# Altium project MKXdbV2.PrjPCB (part 2 of 2)

## Sheet MKXdbV2_PWR.SchDoc
size A
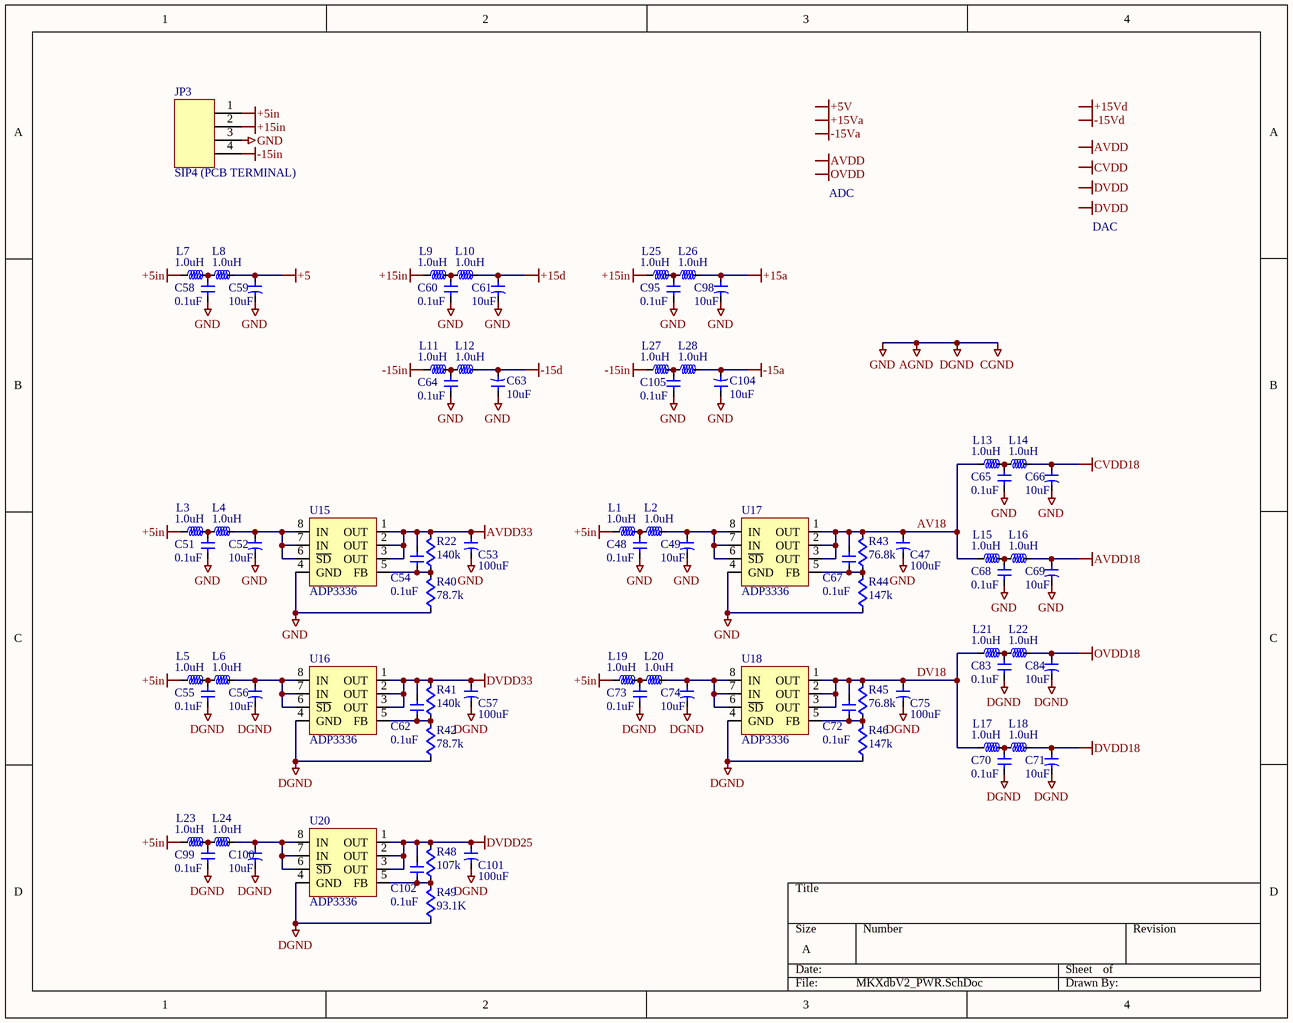
[diagram p3: MKXdbV2_PWR.SchDoc]

### Parts
(Parts that share a designator on the sheet are numbered #1, #2 ... from top to bottom, then left to right.)
C47  100uF  [1206]
C48  0.1uF  [0603w]
C49  10uF  [1206]
C51  0.1uF  [0603w]
C52  10uF  [1206]
C53  100uF  [1206]
C54  0.1uF  [0603w]
C55  0.1uF  [0603w]
C56  10uF  [1206]
C57  100uF  [1206]
C58  0.1uF  [0603w]
C59  10uF  [1206]
C60  0.1uF  [0603w]
C61  10uF  [1206]
C62  0.1uF  [0603w]
C63  10uF  [1206]
C64  0.1uF  [0603w]
C65  0.1uF  [0603w]
C66  10uF  [1206]
C67  0.1uF  [0603w]
C68  0.1uF  [0603w]
C69  10uF  [1206]
C70  0.1uF  [0603w]
C71  10uF  [1206]
C72  0.1uF  [0603w]
C73  0.1uF  [0603w]
C74  10uF  [1206]
C75  100uF  [1206]
C83  0.1uF  [0603w]
C84  10uF  [1206]
C95  0.1uF  [0603w]
C98  10uF  [1206]
C99  0.1uF  [0603w]
C100  10uF  [1206]
C101#1  100uF  [1206]
C102#1  0.1uF  [0603w]
C104#1  10uF  [1206]
C105#1  0.1uF  [0603w]
JP3  SIP4 (PCB TERMINAL)  [SIP4MOLEX]
L1  1.0uH  [1210]
L2  1.0uH  [1210]
L3  1.0uH  [0805]
L4  1.0uH  [0805]
L5  1.0uH  [0805]
L6  1.0uH  [0805]
L7  1.0uH  [1210]
L8  1.0uH  [1210]
L9  1.0uH  [1210]
L10  1.0uH  [1210]
L11  1.0uH  [1210]
L12  1.0uH  [1210]
L13  1.0uH  [0805]
L14  1.0uH  [0805]
L15  1.0uH  [1210]
L16  1.0uH  [1210]
L17  1.0uH  [0805]
L18  1.0uH  [0805]
L19  1.0uH  [0805]
L20  1.0uH  [0805]
L21  1.0uH  [0805]
L22  1.0uH  [0805]
L23  1.0uH  [0805]
L24  1.0uH  [0805]
L25  1.0uH  [1210]
L26  1.0uH  [1210]
L27  1.0uH  [1210]
L28  1.0uH  [1210]
R22  140k  [0603w]
R40  78.7k  [0603w]
R41  140k  [0603w]
R42  78.7k  [0603w]
R43  76.8k  [0603w]
R44  147k  [0603w]
R45  76.8k  [0603w]
R46  147k  [0603w]
R48  107k  [0603w]
R49  93.1K  [0603w]
U15  ADP3336  [MSOP08]
U16  ADP3336  [MSOP08]
U17  ADP3336  [MSOP08]
U18  ADP3336  [MSOP08]
U20  ADP3336  [MSOP08]

### Nets
+5: C59.1 L8.2
+5in: JP3.1 L1.1 L3.1 L5.1 L7.1 L19.1 L23.1
+15a: C98.1 L26.2
+15d: C61.1 L10.2
+15in: JP3.2 L9.1 L25.1
-15a: C104#1.2 L28.2
-15d: C63.2 L12.2
-15in: JP3.4 L11.1 L27.1
AGND: C47.2 C48.2 C49.2 C51.2 C52.2 C53.2 C55.2 C56.2 C57.2 C58.2 C59.2 C60.2 C61.2 C63.1 C64.2 C65.2 C66.2 C68.2 C69.2 C70.2 C71.2 C73.2 C74.2 C75.2 C83.2 C84.2 C95.2 C98.2 C99.2 C100.2 C101#1.2 C104#1.1 C105#1.2 JP3.3 R40.1 R42.1 R44.1 R46.1 R49.1 U15.4(GND) U16.4(GND) U17.4(GND) U18.4(GND) U20.4(GND)  [also labelled CGND, DGND, GND]
AVDD18: C69.1 L16.2
AVDD33: C53.1 C54.1 R22.2 U15.1(OUT) U15.2(OUT) U15.3(OUT)
CVDD18: C66.1 L14.2
DVDD18: C71.1 L18.2
DVDD25: C101#1.1 C102#1.1 R48.2 U20.1(OUT) U20.2(OUT) U20.3(OUT)
DVDD33: C57.1 C62.1 R41.2 U16.1(OUT) U16.2(OUT) U16.3(OUT)
OVDD18: C84.1 L22.2
AV18: C47.1 C67.1 L13.1 L15.1 R43.2 U17.1(OUT) U17.2(OUT) U17.3(OUT)
DV18: C72.1 C75.1 L17.1 L21.1 R45.2 U18.1(OUT) U18.2(OUT) U18.3(OUT)
NetC48_1: C48.1 L1.2 L2.1
NetC49_1: C49.1 L2.2 U17.6(~{SD}) U17.7(IN) U17.8(IN)
NetC51_1: C51.1 L3.2 L4.1
NetC52_1: C52.1 L4.2 U15.6(~{SD}) U15.7(IN) U15.8(IN)
NetC54_2: C54.2 R22.1 R40.2 U15.5(FB)
NetC55_1: C55.1 L5.2 L6.1
NetC56_1: C56.1 L6.2 U16.6(~{SD}) U16.7(IN) U16.8(IN)
NetC58_1: C58.1 L7.2 L8.1
NetC60_1: C60.1 L9.2 L10.1
NetC62_2: C62.2 R41.1 R42.2 U16.5(FB)
NetC64_1: C64.1 L11.2 L12.1
NetC65_1: C65.1 L13.2 L14.1
NetC67_2: C67.2 R43.1 R44.2 U17.5(FB)
NetC68_1: C68.1 L15.2 L16.1
NetC70_1: C70.1 L17.2 L18.1
NetC72_2: C72.2 R45.1 R46.2 U18.5(FB)
NetC73_1: C73.1 L19.2 L20.1
NetC74_1: C74.1 L20.2 U18.6(~{SD}) U18.7(IN) U18.8(IN)
NetC83_1: C83.1 L21.2 L22.1
NetC95_1: C95.1 L25.2 L26.1
NetC99_1: C99.1 L23.2 L24.1
NetC100_1: C100.1 L24.2 U20.6(~{SD}) U20.7(IN) U20.8(IN)
NetC102#1_2: C102#1.2 R48.1 R49.2 U20.5(FB)
NetC105#1_1: C105#1.1 L27.2 L28.1

### Notes on the sheet
- ADC
- DAC
- Labels drawn without touching a wire or pin: +5V, +15Va, +15Vd, -15Va, -15Vd, AVDD, CVDD, DVDD, OVDD

### Library data of the parts
C47 C53 C57 C75 C101#1 = CAPACITOR_SM: capacitor; Manufacturer: TDK Corporation; Manufacturer Part Number: C3216X5R0J107M; Capacitance: 100µF; Voltage - Rated: 6.3V; Tolerance: ±20%; Temperature Coefficient: X5R; Supplier 1: Digi-Key; Supplier Part Number 1: 445-6008-1-ND; RoHS: RoHS Compliant; Category: Capacitors; Stock 1: 10697; Pricing 1: 1=1.24, 10=1.034, 100=0.759, 250=0.66, 500=0.616, 1000=0.484 (USD); Mounting Type: Surface Mount, MLCC; Operating Temperature: -55°C ~ 85°C; Applications: General Purpose; Ratings: -; Package / Case: 1206 (3216 Metric); Size / Dimension: 0.126" L x 0.063" W (3.20mm x 1.60mm); Height: -; Thickness: 0.071" (1.80mm); Lead Spacing: -; Features: Low ESR; Packaging: Cut Tape (CT); Lead Style: -; ComponentLink1URL: http://www.tdk.com/pdf/general_A11.pdf; ComponentLink1Description: http://www.tdk.com/pdf/general_A11.pdf
C48 C51 C54 C55 C58 C60 C62 C64 C65 C67 C68 C70 C72 C73 C83 C95 C99 C102#1 C105#1 = CAP_SM: capacitor; Manufacturer: Kemet; Manufacturer Part Number: C0603C104K3RACTU; Capacitance: 0.1µF; Temperature Coefficient: X7R; Tolerance: ±10%; Voltage - Rated: 25V; Applications: General Purpose; Category: Capacitors; ComponentLink1Description: http://www.kemet.com/datasheets&C0603C104K3RACTU; ComponentLink1URL: http://www.kemet.com/datasheets&C0603C104K3RACTU; Features: -; Lead Spacing: -; Lead Style: -; Mounting Type: Surface Mount, MLCC; Operating Temperature: -55°C ~ 125°C; Package / Case: 0603 (1608 Metric); Packaging: Cut Tape (CT); Pricing 1: 10=0.075, 100=0.027, 250=0.01952, 500=0.0144, 1000=0.00975 (USD); Ratings: -; RoHS: RoHS Compliant; Size / Dimension: 0.063" L x 0.032" W (1.60mm x 0.80mm); Stock 1: 2338960; Supplier 1: Digi-Key; Supplier Part Number 1: 399-1281-1-ND; Thickness: 0.80mm
C49 C52 C56 C59 C61 C63 C66 C69 C71 C74 C84 C100 C104#1 = CAPACITOR_SM: ELECTROLYTIC capacitor; Manufacturer: Nichicon; Manufacturer Part Number: F971C106MAA; Manufacturer Size Code: A; Capacitance: 10µF; Temperature Coefficient: X5R; Tolerance: ±20%; Voltage - Rated: 16V; ESR (Equivalent Series Resistance): 3.500 Ohm; Type: Molded; Applications: General Purpose; Category: Capacitors; ComponentLink1Description: http://nichicon-us.com/english/products/pdf/e-f97.pdf; ComponentLink1URL: http://nichicon-us.com/english/products/pdf/e-f97.pdf; Features: High Reliability; Height: 0.071" (1.80mm); Lead Spacing: -; Lead Style: -; Mounting Type: Surface Mount; Operating Temperature: -55°C ~ 125°C; Package / Case: 1206 (3216 Metric); Packaging: Cut Tape (CT); Pricing 1: 1=0.5, 10=0.398, 100=0.24, 250=0.18, 500=0.1536, 1000=0.12 (USD); Ratings: -; RoHS: RoHS Compliant; Size / Dimension: 0.126" L x 0.063" W (3.20mm x 1.60mm); Stock 1: 885; Supplier 1: Digi-Key; Supplier Part Number 1: 493-4304-1-ND; Thickness: 0.071" (1.80mm); Lifetime @ Temp.: -
C98 = CAPACITOR_SM: ELECTROLYTIC capacitor; Manufacturer: Nichicon; Manufacturer Part Number: F971C106MAA; Manufacturer Size Code: A; Capacitance: 10µF; Voltage - Rated: 16V; Tolerance: ±20%; Temperature Coefficient: X5R; ESR (Equivalent Series Resistance): 3.500 Ohm; Type: Molded; Supplier 1: Digi-Key; Supplier Part Number 1: 493-4304-1-ND; RoHS: RoHS Compliant; Category: Capacitors; Stock 1: 885; Pricing 1: 1=0.5, 10=0.398, 100=0.24, 250=0.18, 500=0.1536, 1000=0.12 (USD); Mounting Type: Surface Mount; Operating Temperature: -55°C ~ 125°C; Applications: General Purpose; Ratings: -; Package / Case: 1206 (3216 Metric); Size / Dimension: 0.126" L x 0.063" W (3.20mm x 1.60mm); Height: 0.071" (1.80mm); Thickness: 0.071" (1.80mm); Lead Spacing: -; Features: High Reliability; Packaging: Cut Tape (CT); Lead Style: -; ComponentLink1URL: http://nichicon-us.com/english/products/pdf/e-f97.pdf; ComponentLink1Description: http://nichicon-us.com/english/products/pdf/e-f97.pdf; Lifetime @ Temp.: -
JP3 = SIP4 (PCB TERMINAL): 4 pin molex connector; Manufacturer: Molex Inc; Connector Type: Header, Unshrouded; Number of Positions: 4; Number of Positions Loaded: All; Pitch: 0.100" (2.54mm); Supplier 1: Digi-Key; Supplier Part Number 1: WM2746-ND; Manufacturer Part Number: 22-29-2041; RoHS: RoHS Compliant; Category: Connectors, Interconnects; Stock 1: 6126; Pricing 1: 1=0.95, 10=0.664, 50=0.5124, 100=0.446, 250=0.3796, 500=0.36062, 1000=0.32266, 2500=0.25623, 5000=0.25243 (USD); Contact Type: Male Pin; Number of Rows: 1; Row Spacing: -; Contact Mating Length: 0.295" (7.49mm); Mounting Type: Through Hole; Termination: Solder; Fastening Type: Friction Lock; Features: -; Contact Finish: Gold; Contact Finish Thickness: 20µin (0.51µm); Color: White; Packaging: Bulk; ComponentLink1URL: http://www.molex.com/pdm_docs/sd/022292041_sd.pdf; ComponentLink1Description: http://www.molex.com/pdm_docs/sd/022292041_sd.pdf
L1 L7 L9 L11 L15 L25 L27 = INDUCTOR_SM: inductor; Manufacturer: Murata Electronics North America; Manufacturer Part Number: LQH32CN1R0M23L; Current: 800mA; DC Resistance (DCR): 117 mOhm Max; Frequency - Test: 1MHz; Inductance: 1µH; Self Resonant Freq: 96MHz; Shielding: Unshielded; Tolerance: ±20%; Type: Ferrite Core; Material - Core: Ferrite; Applications: Power Supplies; Category: Inductors, Coils, Chokes; ComponentLink1Description: http://search.murata.co.jp/Ceramy/image/img/PDF/ENG/L0075S0093LQH32C_23~33.pdf; ComponentLink1URL: http://search.murata.co.jp/Ceramy/image/img/PDF/ENG/L0075S0093LQH32C_23~33.pdf; Current - Saturation: -; Current - Temperature Rise: -; Mounting Type: Surface Mount; Operating Temperature: -40°C ~ 85°C; Package / Case: 1210 (3225 Metric); Packaging: Cut Tape (CT); Q @ Freq: -; RoHS: RoHS Compliant; Supplier 1: Digi-Key; Supplier Part Number 1: 490-2493-1-ND; Stock 1: 5265; Pricing 1: 1=0.27, 10=0.258, 50=0.2422, 100=0.2261, 500=0.17766, 1000=0.14535 (USD)
L2 L8 L10 L12 L16 L26 L28 = INDUCTOR_SM: inductor; Manufacturer: Murata Electronics North America; Manufacturer Part Number: LQH32CN1R0M23L; Inductance: 1µH; Current: 800mA; Type: Ferrite Core; Tolerance: ±20%; Shielding: Unshielded; DC Resistance (DCR): 117 mOhm Max; Self Resonant Freq: 96MHz; Frequency - Test: 1MHz; Material - Core: Ferrite; RoHS: RoHS Compliant; Category: Inductors, Coils, Chokes; Current - Saturation: -; Current - Temperature Rise: -; Q @ Freq: -; Package / Case: 1210 (3225 Metric); Mounting Type: Surface Mount; Packaging: Cut Tape (CT); Operating Temperature: -40°C ~ 85°C; Applications: Power Supplies; ComponentLink1URL: http://search.murata.co.jp/Ceramy/image/img/PDF/ENG/L0075S0093LQH32C_23~33.pdf; ComponentLink1Description: http://search.murata.co.jp/Ceramy/image/img/PDF/ENG/L0075S0093LQH32C_23~33.pdf; Supplier 1: Digi-Key; Supplier Part Number 1: 490-2493-1-ND; Stock 1: 5265; Pricing 1: 1=0.27, 10=0.258, 50=0.2422, 100=0.2261, 500=0.17766, 1000=0.14535 (USD)
L3 L5 L13 L17 L19 L21 L23 = INDUCTOR_SM: inductor; Manufacturer: Murata Electronics North America; Manufacturer Part Number: LQM21FN1R0N00D; Current: 220mA; DC Resistance (DCR): 260 mOhm Max; Frequency - Test: 1MHz; Inductance: 1µH; Self Resonant Freq: 105MHz; Shielding: Shielded; Tolerance: ±30%; Current - Saturation: -; Current - Temperature Rise: -; Mounting Type: Surface Mount; Operating Temperature: -40°C ~ 85°C; Package / Case: 0805 (2012 Metric); Packaging: Cut Tape (CT); Q @ Freq: -; RoHS: RoHS Compliant; Type: -; Supplier 1: Digi-Key; Supplier Part Number 1: 490-4026-1-ND; Stock 1: 0; Pricing 1: 1=0.11, 10=0.104, 50=0.0972, 100=0.0907, 500=0.07122, 1000=0.05828 (USD); Material - Core: -
L4 L6 L14 L18 L20 L22 L24 = INDUCTOR_SM: inductor; Manufacturer: Murata Electronics North America; Manufacturer Part Number: LQM21FN1R0N00D; Inductance: 1µH; Current: 220mA; Tolerance: ±30%; Shielding: Shielded; DC Resistance (DCR): 260 mOhm Max; Self Resonant Freq: 105MHz; Frequency - Test: 1MHz; RoHS: RoHS Compliant; Current - Saturation: -; Current - Temperature Rise: -; Type: -; Q @ Freq: -; Package / Case: 0805 (2012 Metric); Mounting Type: Surface Mount; Packaging: Cut Tape (CT); Operating Temperature: -40°C ~ 85°C; Supplier 1: Digi-Key; Supplier Part Number 1: 490-4026-1-ND; Stock 1: 0; Pricing 1: 1=0.11, 10=0.104, 50=0.0972, 100=0.0907, 500=0.07122, 1000=0.05828 (USD); Material - Core: -
R22 R41 = RES_SM: resistor; Manufacturer: Yageo; Manufacturer Part Number: RC0603FR-07140KL; Power (Watts): 0.1W, 1/10W; Temperature Coefficient: ±100ppm/°C; Tolerance: ±1%; Supplier 1: Digi-Key; Supplier Part Number 1: 311-140KHRCT-ND; RoHS: RoHS Compliant; Category: Resistors; Stock 1: 612355; Pricing 1: 10=0.014, 50=0.0104, 100=0.0079, 250=0.00584, 500=0.00432, 1000=0.00288 (USD); Resistance (Ohms): 140K; Composition: Thick Film; Features: -; Size / Dimension: 0.063" L x 0.031" W (1.60mm x 0.80mm); Height: 0.018" (0.45mm); Number of Terminations: 2; Packaging: Cut Tape (CT); Package / Case: 0603 (1608 Metric); ComponentLink1URL: http://www.yageo.com/documents/recent/PYu-RC0603_51_RoHS_L_4.pdf; ComponentLink1Description: http://www.yageo.com/documents/recent/PYu-RC0603_51_RoHS_L_4.pdf
R40 R42 = RES_SM: resistor; Manufacturer: Yageo; Manufacturer Part Number: RC0603FR-0778K7L; Power (Watts): 0.1W, 1/10W; Temperature Coefficient: ±100ppm/°C; Tolerance: ±1%; Supplier 1: Digi-Key; Supplier Part Number 1: 311-78.7KHRCT-ND; RoHS: RoHS Compliant; Category: Resistors; Stock 1: 134270; Pricing 1: 10=0.014, 50=0.0104, 100=0.0079, 250=0.00584, 500=0.00432, 1000=0.00288 (USD); Resistance (Ohms): 78.7K; Composition: Thick Film; Features: -; Size / Dimension: 0.063" L x 0.031" W (1.60mm x 0.80mm); Height: 0.018" (0.45mm); Number of Terminations: 2; Packaging: Cut Tape (CT); Package / Case: 0603 (1608 Metric); ComponentLink1URL: http://www.yageo.com/documents/recent/PYu-RC0603_51_RoHS_L_4.pdf; ComponentLink1Description: http://www.yageo.com/documents/recent/PYu-RC0603_51_RoHS_L_4.pdf
R43 R45 = RES_SM: resistor; Manufacturer: Yageo; Manufacturer Part Number: RC0603FR-0776K8L; Power (Watts): 0.1W, 1/10W; Temperature Coefficient: ±100ppm/°C; Tolerance: ±1%; Supplier 1: Digi-Key; Supplier Part Number 1: 311-76.8KHRCT-ND; RoHS: RoHS Compliant; Category: Resistors; Stock 1: 91480; Pricing 1: 10=0.014, 50=0.0104, 100=0.0079, 250=0.00584, 500=0.00432, 1000=0.00288 (USD); Resistance (Ohms): 76.8K; Composition: Thick Film; Features: -; Size / Dimension: 0.063" L x 0.031" W (1.60mm x 0.80mm); Height: 0.018" (0.45mm); Number of Terminations: 2; Packaging: Cut Tape (CT); Package / Case: 0603 (1608 Metric); ComponentLink1URL: http://www.yageo.com/documents/recent/PYu-RC0603_51_RoHS_L_4.pdf; ComponentLink1Description: http://www.yageo.com/documents/recent/PYu-RC0603_51_RoHS_L_4.pdf
R44 R46 = RES_SM: resistor; Manufacturer: Yageo; Manufacturer Part Number: RC0603FR-07147KL; Power (Watts): 0.1W, 1/10W; Temperature Coefficient: ±100ppm/°C; Tolerance: ±1%; Supplier 1: Digi-Key; Supplier Part Number 1: 311-147KHRCT-ND; RoHS: RoHS Compliant; Category: Resistors; Stock 1: 53540; Pricing 1: 10=0.014, 50=0.0104, 100=0.0079, 250=0.00584, 500=0.00432, 1000=0.00288 (USD); Resistance (Ohms): 147K; Composition: Thick Film; Features: -; Size / Dimension: 0.063" L x 0.031" W (1.60mm x 0.80mm); Height: 0.018" (0.45mm); Number of Terminations: 2; Packaging: Cut Tape (CT); Package / Case: 0603 (1608 Metric); ComponentLink1URL: http://www.yageo.com/documents/recent/PYu-RC0603_51_RoHS_L_4.pdf; ComponentLink1Description: http://www.yageo.com/documents/recent/PYu-RC0603_51_RoHS_L_4.pdf
R48 = RES_SM: resistor; Manufacturer: Yageo; Manufacturer Part Number: RC0603FR-07107KL; Power (Watts): 0.1W, 1/10W; Temperature Coefficient: ±100ppm/°C; Tolerance: ±1%; Supplier 1: Digi-Key; Supplier Part Number 1: 311-107KHRCT-ND; RoHS: RoHS Compliant; Category: Resistors; Stock 1: 136570; Pricing 1: 10=0.014, 50=0.0104, 100=0.0079, 250=0.00584, 500=0.00432, 1000=0.00288 (USD); Resistance (Ohms): 107K; Composition: Thick Film; Features: -; Size / Dimension: 0.063" L x 0.031" W (1.60mm x 0.80mm); Height: 0.018" (0.45mm); Number of Terminations: 2; Packaging: Cut Tape (CT); Package / Case: 0603 (1608 Metric); ComponentLink1URL: http://www.yageo.com/documents/recent/PYu-RC0603_51_RoHS_L_4.pdf; ComponentLink1Description: http://www.yageo.com/documents/recent/PYu-RC0603_51_RoHS_L_4.pdf
R49 = RES_SM: resistor; Manufacturer: Yageo; Manufacturer Part Number: RC0603FR-0793K1L; Power (Watts): 0.1W, 1/10W; Temperature Coefficient: ±100ppm/°C; Tolerance: ±1%; Supplier 1: Digi-Key; Supplier Part Number 1: 311-93.1KHRCT-ND; RoHS: RoHS Compliant; Category: Resistors; Stock 1: 109138; Pricing 1: 10=0.014, 50=0.0104, 100=0.0079, 250=0.00584, 500=0.00432, 1000=0.00288 (USD); Resistance (Ohms): 93.1K; Composition: Thick Film; Features: -; Size / Dimension: 0.063" L x 0.031" W (1.60mm x 0.80mm); Height: 0.018" (0.45mm); Number of Terminations: 2; Packaging: Cut Tape (CT); Package / Case: 0603 (1608 Metric); ComponentLink1URL: http://www.yageo.com/documents/recent/PYu-RC0603_51_RoHS_L_4.pdf; ComponentLink1Description: http://www.yageo.com/documents/recent/PYu-RC0603_51_RoHS_L_4.pdf
U15-U18 U20 = ADP3336: regulator; Manufacturer: Analog Devices Inc; Manufacturer Part Number: ADP3336ARMZ-REEL7; Regulator Topology: Positive Adjustable; Voltage - Output: 1.5 V ~ 10 V; Voltage - Input: 2.6 V ~ 12 V; Voltage - Dropout (Typical): 0.2V @ 500mA; Number of Regulators: 1; Current - Output: 500mA; Supplier 1: Digi-Key; Supplier Part Number 1: ADP3336ARMZ-REEL7CT-ND; RoHS: RoHS Compliant; Category: Integrated Circuits (ICs); Stock 1: 10613; Pricing 1: 1=3.22, 25=2.484, 100=2.254, 250=2.024, 500=1.748 (USD); Current - Limit (Min): -; Operating Temperature: -40°C ~ 85°C; Mounting Type: Surface Mount; Package / Case: 8-TSSOP, 8-MSOP (0.118", 3.00mm Width); Supplier Device Package: 8-MSOP; Packaging: Cut Tape (CT); ComponentLink1URL: http://www.analog.com/static/imported-files/data_sheets/ADP3336.pdf; ComponentLink1Description: http://www.analog.com/static/imported-files/data_sheets/ADP3336.pdf

## Sheet MKXdbV2_ADC0.SchDoc
size A
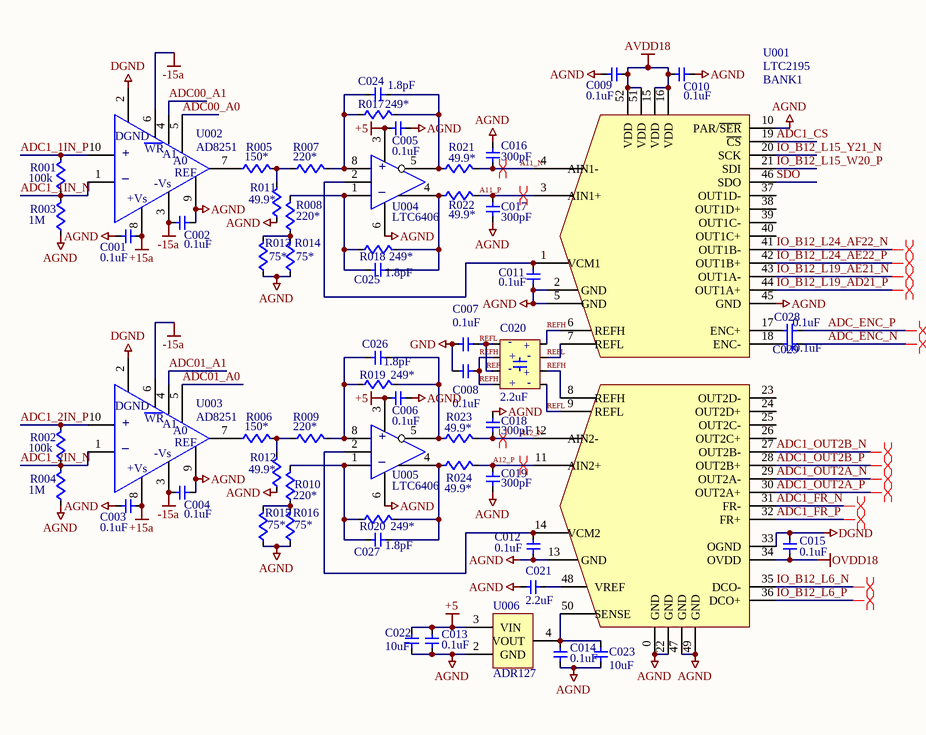
[diagram p4: MKXdbV2_ADC0.SchDoc]

### Parts
C001  0.1uF  [0603w]
C002  0.1uF  [0603w]
C003  0.1uF  [0603w]
C004  0.1uF  [0603w]
C005  0.1uF  [0603w]
C006  0.1uF  [0603w]
C007  0.1uF  [0603w]
C008  0.1uF  [0603w]
C009  0.1uF  [0603w]
C010  0.1uF  [0603w]
C011  0.1uF  [0603w]
C012  0.1uF  [0603w]
C013  0.1uF  [0603w]
C014  0.1uF  [0603w]
C015  0.1uF  [0603w]
C016  300pF  [0603w]
C017  300pF  [0603w]
C018  300pF  [0603w]
C019  300pF  [0603w]
C020  2.2uF  [1206CLL]
C021  2.2uF  [0603w]
C022  10uF  [0603w]
C023  10uF  [0603w]
C024  1.8pF  [0603w]
C025  1.8pF  [0603w]
C026  1.8pF  [0603w]
C027  1.8pF  [0603w]
C028  0.1uF  [1206]
C029  0.1uF  [1206]
R001  100k  [0603w]
R002  100k  [0603w]
R003  1M  [0603w]
R004  1M  [0603w]
R005  150*  [0603w]
R006  150*  [0603w]
R007  220*  [0603w]
R008  220*  [0603w]
R009  220*  [0603w]
R010  220*  [0603w]
R011  49.9*  [0603w]
R012  49.9*  [0603w]
R013  75*  [0603w]
R014  75*  [0603w]
R015  75*  [0603w]
R016  75*  [0603w]
R017  249*  [0603w]
R018  249*  [0603w]
R019  249*  [0603w]
R020  249*  [0603w]
R021  49.9*  [0603w]
R022  49.9*  [0603w]
R023  49.9*  [0603w]
R024  49.9*  [0603w]
U001  LTC2195  [UKG - QFN52]
U002  AD8251  [MSOP10sm]
U003  AD8251  [MSOP10sm]
U004  LTC6406  [MSOP08]
U005  LTC6406  [MSOP08]
U006  ADR127  [TSOT-6]

### Nets
+5: C005.1 C006.1 C013.2 C022.1 U004.3 U005.3 U006.3(VIN)
+15a: C001.1 C003.1 U002.8 U003.8
-15a: C002.1 C004.1 U002.3 U002.6 U003.3 U003.6
AGND: C001.2 C002.2 C003.2 C004.2 C005.2 C006.2 C007.2 C008.2 C009.2 C010.2 C011.2 C012.2 C013.1 C014.1 C015.1 C016.1 C017.2 C018.1 C019.2 C021.2 C022.2 C023.2 R003.1 R004.1 R011.1 R012.1 R013.1 R014.1 R015.1 R016.1 U001.0(GND) U001.2(GND) U001.5(GND) U001.10(PAR/~{SER}) U001.13(GND) U001.22(GND) U001.33(OGND) U001.45(GND) U001.47(GND) U001.49(GND) U002.2 U002.9 U003.2 U003.9 U004.6 U005.6 U006.2(GND)  [also labelled DGND, GND]
AVDD18: C009.1 C010.1 U001.15(VDD) U001.16(VDD) U001.51(VDD) U001.52(VDD)
OVDD18: C015.2 U001.34(OVDD)
A11_N: C016.2 R021.2 U001.4(AIN1-)
A11_P: C017.1 R022.2 U001.3(AIN1+)
A12_N: C018.2 R023.2 U001.12(AIN2-)
A12_P: C019.1 R024.2 U001.11(AIN2+)
ADC00_A0: U002.5
ADC00_A1: U002.4
ADC1_1IN_N: R001.1 R003.2 U002.1
ADC1_1IN_P: R001.2 U002.10
ADC1_2IN_N: R002.1 R004.2 U003.1
ADC1_2IN_P: R002.2 U003.10
ADC01_A0: U003.5
ADC01_A1: U003.4
ADC1_CS: U001.19(~{CS})
ADC1_FR_N: U001.31(FR-)
ADC1_FR_P: U001.32(FR+)
ADC1_OUT2A_N: U001.29(OUT2A-)
ADC1_OUT2A_P: U001.30(OUT2A+)
ADC1_OUT2B_N: U001.27(OUT2B-)
ADC1_OUT2B_P: U001.28(OUT2B+)
ADC_ENC_N: C029.2
ADC_ENC_P: C028.2
IO_B12_L6_N: U001.35(DCO-)
IO_B12_L6_P: U001.36(DCO+)
IO_B12_L15_W20_P: U001.21(SDI)
IO_B12_L15_Y21_N: U001.20(SCK)
IO_B12_L19_AD21_P: U001.44(OUT1A+)
IO_B12_L19_AE21_N: U001.43(OUT1A-)
IO_B12_L24_AE22_P: U001.42(OUT1B+)
IO_B12_L24_AF22_N: U001.41(OUT1B-)
REFH: C008.1 C020.2 C020.4 C020.6 C020.8 U001.6(REFH) U001.8(REFH)
REFL: C007.1 C020.1 C020.3 C020.5 C020.7 U001.7(REFL) U001.9(REFL)
SDO: U001.46(SDO)
NetC011_1: C011.1 U001.1(VCM1) U004.2
NetC012_1: C012.1 U001.14(VCM2) U005.2
NetC014_2: C014.2 C023.1 U001.50(SENSE) U006.4(VOUT)
NetC021_1: C021.1 U001.48(VREF)
NetC024_1: C024.1 R007.2 R017.1 U004.8
NetC024_2: C024.2 R017.2 R021.1 U004.5
NetC025_1: C025.1 R008.2 R018.1 U004.1
NetC025_2: C025.2 R018.2 R022.1 U004.4
NetC026_1: C026.1 R009.2 R019.1 U005.8
NetC026_2: C026.2 R019.2 R023.1 U005.5
NetC027_1: C027.1 R010.2 R020.1 U005.1
NetC027_2: C027.2 R020.2 R024.1 U005.4
NetC028_1: C028.1 U001.17(ENC+)
NetC029_1: C029.1 U001.18(ENC-)
NetR005_1: R005.1 U002.7
NetR005_2: R005.2 R007.1 R011.2
NetR006_1: R006.1 U003.7
NetR006_2: R006.2 R009.1 R012.2
NetR008_1: R008.1 R013.2 R014.2
NetR010_1: R010.1 R015.2 R016.2

Not connected (* = marked no-connect by the designer): U001 23(OUT2D-) 24(OUT2D+) 25(OUT2C-) 26(OUT2C+) 37(OUT1D-) 38(OUT1D+) 39(OUT1C-) 40(OUT1C+); U006 1(NC) 5(NC) 6(NC)

### Layout directives
differential pair: A11_N, A11_P, A12_N, A12_P, ADC1_FR_N, ADC1_FR_P, ADC1_OUT2A_N, ADC1_OUT2A_P, ADC1_OUT2B_N, ADC1_OUT2B_P, ADC_ENC_N, ADC_ENC_P, IO_B12_L6_N, IO_B12_L6_P, IO_B12_L19_AD21_P, IO_B12_L19_AE21_N, IO_B12_L24_AE22_P, IO_B12_L24_AF22_N

### Notes on the sheet
- (near U001) BANK1
- (in symbol AD8139) +; _
- (in symbol AD8251) DGND; WR; +; A1; A0; _; REF; -Vs; +Vs
- (in symbol CAP_SM Interdigitated) +

### Library data of the parts
C001 C002 C003 C004 C006 C007 C008 C009 C010 C011 C012 C013 C014 C015 = CAP_SM_1: capacitor; Manufacturer: Kemet; Manufacturer Part Number: C0603C104K3RACTU; Capacitance: 0.1µF; Temperature Coefficient: X7R; Tolerance: ±10%; Voltage - Rated: 25V; Applications: General Purpose; Category: Capacitors; ComponentLink1Description: http://www.kemet.com/datasheets&C0603C104K3RACTU; ComponentLink1URL: http://www.kemet.com/datasheets&C0603C104K3RACTU; Features: -; Lead Spacing: -; Lead Style: -; Mounting Type: Surface Mount, MLCC; Operating Temperature: -55°C ~ 125°C; Package / Case: 0603 (1608 Metric); Packaging: Cut Tape (CT); Pricing 1: 10=0.075, 100=0.027, 250=0.01952, 500=0.0144, 1000=0.00975 (USD); Ratings: -; RoHS: RoHS Compliant; Size / Dimension: 0.063" L x 0.031" W (1.60mm x 0.80mm); Stock 1: 1185883; Supplier 1: Digi-Key; Supplier Part Number 1: 399-1281-1-ND; Thickness: 0.034" (0.87mm)
C005 = CAP_SM_1: capacitor; Manufacturer: Kemet; Manufacturer Part Number: C0603C104K3RACTU; Capacitance: 0.1µF; Voltage - Rated: 25V; Tolerance: ±10%; Temperature Coefficient: X7R; Supplier 1: Digi-Key; Supplier Part Number 1: 399-1281-1-ND; RoHS: RoHS Compliant; Category: Capacitors; Stock 1: 1185883; Pricing 1: 10=0.075, 100=0.027, 250=0.01952, 500=0.0144, 1000=0.00975 (USD); Mounting Type: Surface Mount, MLCC; Operating Temperature: -55°C ~ 125°C; Applications: General Purpose; Ratings: -; Package / Case: 0603 (1608 Metric); Size / Dimension: 0.063" L x 0.031" W (1.60mm x 0.80mm); Height: -; Thickness: 0.034" (0.87mm); Lead Spacing: -; Features: -; Packaging: Cut Tape (CT); Lead Style: -; ComponentLink1URL: http://www.kemet.com/datasheets&C0603C104K3RACTU; ComponentLink1Description: http://www.kemet.com/datasheets&C0603C104K3RACTU
C016 C017 C018 C019 C024 C025 C026 C027 = CAP_SM_1: capacitor; Supplier 1: Digi-Key
  C016 C017 C018 C019: Supplier Part Number 1: 490-1438-1-ND
  C024 C025 C026 C027: Supplier Part Number 1: 712-1328-1-ND
C020 = CAP_SM Interdigitated: INTERDIGITATED capacitor; Manufacturer: TDK Corporation; Manufacturer Part Number: CLLE1AX7S0G225M/0.95; Capacitance: 2.2µF; Voltage - Rated: 4V; Tolerance: ±20%; Temperature Coefficient: X7S; Supplier 1: Digi-Key; Supplier Part Number 1: 445-3406-1-ND; RoHS: RoHS Compliant; Category: Capacitors; Stock 1: 11249; Pricing 1: 1=0.68, 10=0.54, 100=0.325, 250=0.24376, 500=0.208, 1000=0.1625 (USD); Mounting Type: Surface Mount, MLCC; Operating Temperature: -55°C ~ 125°C; Applications: General Purpose; Ratings: -; Package / Case: 0805 (2012 Metric); Size / Dimension: 0.079" L x 0.049" W (2.00mm x 1.25mm); Height: -; Thickness: 0.037" (0.95mm); Lead Spacing: -; Features: Low ESL (Multi-Terminal); Packaging: Cut Tape (CT); Lead Style: -; ComponentLink1URL: http://www.tdk.com/pdf/uli_A11.pdf; ComponentLink1Description: http://www.tdk.com/pdf/uli_A11.pdf
C021 = CAP_SM_1: capacitor; Manufacturer: AVX Corporation; Manufacturer Part Number: 06036C225KAT2A; Capacitance: 2.2µF; Voltage - Rated: 6.3V; Tolerance: ±10%; Temperature Coefficient: X7R; Supplier 1: Digi-Key; Supplier Part Number 1: 478-5316-1-ND; RoHS: RoHS Compliant; Category: Capacitors; Stock 1: 284343; Pricing 1: 10=0.209, 100=0.1235, 500=0.07126, 1000=0.0494 (USD); Mounting Type: Surface Mount, MLCC; Operating Temperature: -55°C ~ 125°C; Applications: General Purpose; Ratings: -; Package / Case: 0603 (1608 Metric); Size / Dimension: 0.063" L x 0.032" W (1.60mm x 0.81mm); Height: -; Thickness: 0.035" (0.90mm); Lead Spacing: -; Features: -; Packaging: Cut Tape (CT); Lead Style: -; ComponentLink1URL: http://www.avx.com/docs/Catalogs/cx7r.pdf; ComponentLink1Description: http://www.avx.com/docs/Catalogs/cx7r.pdf
C022 C023 = CAP_SM_1: capacitor; Manufacturer: Murata Electronics North America; Manufacturer Part Number: GRM188R60J106ME47D; Capacitance: 10µF; Voltage - Rated: 6.3V; Tolerance: ±20%; Temperature Coefficient: X5R; Supplier 1: Digi-Key; Supplier Part Number 1: 490-3896-1-ND; RoHS: RoHS Compliant; Category: Capacitors; Stock 1: 1274844; Pricing 1: 1=0.47, 10=0.369, 50=0.2428, 100=0.1926, 250=0.14236, 500=0.11056, 1000=0.0871 (USD); Mounting Type: Surface Mount, MLCC; Operating Temperature: -55°C ~ 85°C; Applications: General Purpose; Ratings: -; Package / Case: 0603 (1608 Metric); Size / Dimension: 0.063" L x 0.031" W (1.60mm x 0.80mm); Height: -; Thickness: 0.035" (0.90mm); Lead Spacing: -; Features: -; Packaging: Cut Tape (CT); Lead Style: -; ComponentLink1URL: http://search.murata.co.jp/Ceramy/image/img/PDF/ENG/GRM188R60J106ME47.pdf; ComponentLink1Description: http://search.murata.co.jp/Ceramy/image/img/PDF/ENG/GRM188R60J106ME47.pdf
C028 C029 = CAP_SM_1: capacitor; Manufacturer: Murata Electronics North America; Manufacturer Part Number: GRM31C5C1E104JA01L; Capacitance: 0.1µF; Voltage - Rated: 25V; Tolerance: ±5%; Temperature Coefficient: C0G, NP0; Supplier 1: Digi-Key; Supplier Part Number 1: 490-1767-1-ND; RoHS: RoHS Compliant; Category: Capacitors; Stock 1: 374793; Pricing 1: 1=0.57, 10=0.48, 50=0.3436, 100=0.3007, 250=0.23628, 500=0.2148, 1000=0.17184 (USD); Mounting Type: Surface Mount, MLCC; Operating Temperature: -55°C ~ 125°C; Applications: General Purpose; Ratings: -; Package / Case: 1206 (3216 Metric); Size / Dimension: 0.126" L x 0.063" W (3.20mm x 1.60mm); Height: -; Thickness: 0.071" (1.80mm); Lead Spacing: -; Features: -; Packaging: Cut Tape (CT); Lead Style: -; ComponentLink1URL: http://search.murata.co.jp/Ceramy/image/img/PDF/ENG/GRM31C5C1E104JA01.pdf; ComponentLink1Description: http://search.murata.co.jp/Ceramy/image/img/PDF/ENG/GRM31C5C1E104JA01.pdf
R001 R002 = RES_SM: resistor; Manufacturer: Yageo; Manufacturer Part Number: RC0603FR-07100KL; Power (Watts): 0.1W, 1/10W; Temperature Coefficient: ±100ppm/°C; Tolerance: ±1%; Supplier 1: Digi-Key; Supplier Part Number 1: 311-100KHRCT-ND; RoHS: RoHS Compliant; Category: Resistors; Stock 1: 3397757; Pricing 1: 10=0.014, 50=0.0104, 100=0.0079, 250=0.00584, 500=0.00432, 1000=0.00288 (USD); Resistance (Ohms): 100K; Composition: Thick Film; Features: -; Size / Dimension: 0.063" L x 0.031" W (1.60mm x 0.80mm); Height: 0.018" (0.45mm); Number of Terminations: 2; Packaging: Cut Tape (CT); Package / Case: 0603 (1608 Metric); ComponentLink1URL: http://www.yageo.com/documents/recent/PYu-RC0603_51_RoHS_L_4.pdf; ComponentLink1Description: http://www.yageo.com/documents/recent/PYu-RC0603_51_RoHS_L_4.pdf
R003 R004 = RES_SM: resistor; Manufacturer: Yageo; Manufacturer Part Number: RC0603FR-071ML; Power (Watts): 0.1W, 1/10W; Temperature Coefficient: ±100ppm/°C; Tolerance: ±1%; Supplier 1: Digi-Key; Supplier Part Number 1: 311-1.00MHRCT-ND; RoHS: RoHS Compliant; Category: Resistors; Stock 1: 1849601; Pricing 1: 10=0.014, 50=0.0104, 100=0.0079, 250=0.00584, 500=0.00432, 1000=0.00288 (USD); Resistance (Ohms): 1M; Composition: Thick Film; Features: -; Size / Dimension: 0.063" L x 0.031" W (1.60mm x 0.80mm); Height: 0.018" (0.45mm); Number of Terminations: 2; Packaging: Cut Tape (CT); Package / Case: 0603 (1608 Metric); ComponentLink1URL: http://www.yageo.com/documents/recent/PYu-RC0603_51_RoHS_L_4.pdf; ComponentLink1Description: http://www.yageo.com/documents/recent/PYu-RC0603_51_RoHS_L_4.pdf
R005 R006 R007 R008 R009 R010 R017 R018 R019 R020 = RES_SM: resistor; Supplier 1: Digi-Key
  R005 R006: Supplier Part Number 1: RNCS0603BKE150RCT-ND
  R007 R008 R009 R010: Supplier Part Number 1: RG16P220BCT-ND
  R017 R018 R019 R020: Supplier Part Number 1: RNCS0603BKE249RCT-ND
R011 R012 R021 R022 R023 R024 = RES_SM: resistor; Manufacturer: Stackpole Electronics Inc; Manufacturer Part Number: RNCS0603BKE49R9; Resistance (Ohms): 49.9; Power (Watts): 0.063W, 1/16W; Temperature Coefficient: ±25ppm/°C; Tolerance: ±0.1%; Supplier 1: Digi-Key; Supplier Part Number 1: RNCS0603BKE49R9CT-ND; RoHS: RoHS Compliant; Category: Resistors; Stock 1: 13782; Pricing 1: 1=0.7, 10=0.475, 50=0.2876, 100=0.2375, 250=0.18752, 500=0.16 (USD); Composition: Thin Film; Features: Anti-Corrosive, Moisture Resistant; Size / Dimension: 0.061" L x 0.031" W (1.55mm x 0.80mm); Height: 0.018" (0.45mm); Number of Terminations: 2; Packaging: Cut Tape (CT); Package / Case: 0603 (1608 Metric); ComponentLink1URL: http://www.seielect.com/Catalog/SEI-rncs.pdf; ComponentLink1Description: http://www.seielect.com/Catalog/SEI-rncs.pdf
R013 R014 R015 R016 = RES_SM: resistor; Manufacturer: Stackpole Electronics Inc; Manufacturer Part Number: RNCS0603BKE75R0; Resistance (Ohms): 75; Power (Watts): 0.063W, 1/16W; Temperature Coefficient: ±25ppm/°C; Tolerance: ±0.1%; Supplier 1: Digi-Key; Supplier Part Number 1: RNCS0603BKE75R0CT-ND; RoHS: RoHS Compliant; Category: Resistors; Stock 1: 2583; Pricing 1: 1=0.7, 10=0.475, 50=0.2876, 100=0.2375, 250=0.18752, 500=0.16 (USD); Composition: Thin Film; Features: Anti-Corrosive, Moisture Resistant; Size / Dimension: 0.061" L x 0.031" W (1.55mm x 0.80mm); Height: 0.018" (0.45mm); Number of Terminations: 2; Packaging: Cut Tape (CT); Package / Case: 0603 (1608 Metric); ComponentLink1URL: http://www.seielect.com/Catalog/SEI-rncs.pdf; ComponentLink1Description: http://www.seielect.com/Catalog/SEI-rncs.pdf
U001 = LTC2195: 16 bit, low power, dual ADC; Supplier 1: Digi-Key; Supplier Part Number 1: LTC2195CUKG#PBF-ND
U002 = AD8251: Programmable Gain Instumentation Amp; Supplier 1: Digi-Key; Supplier Part Number 1: AD8251ARMZ-ND
U003 = AD8251: IC AMP INST ICMOS LDRIFT 10MSOP; Supplier 1: Digi-Key; Supplier Part Number 1: AD8251ARMZ-ND
U004 U005 = AD8139: Differential ADC Driver; Supplier 1: Digi-Key; Supplier Part Number 1: LTC6406CMS8E#PBF-ND
U006 = ADR12x: Voltage Reference; Manufacturer: Analog Devices Inc; Manufacturer Part Number: ADR127AUJZ-REEL7; Reference Type: Series, Precision; Voltage - Output: 1.25V; Tolerance: ±0.24%; Temperature Coefficient: 25ppm/°C; Voltage - Input: 2.7 V ~ 18 V; Number of Channels: 1; Current - Quiescent: 95µA; Current - Output: 5mA; Supplier 1: Digi-Key; Supplier Part Number 1: ADR127AUJZ-REEL7CT-ND; RoHS: RoHS Compliant; Category: Integrated Circuits (ICs); Stock 1: 17098; Pricing 1: 1=3.22, 25=2.484, 100=2.254, 250=2.024, 500=1.748 (USD); Current - Cathode: -; Operating Temperature: -40°C ~ 125°C; Mounting Type: Surface Mount; Package / Case: TSOT-23-6, TSOT-6; Supplier Device Package: TSOT-6; Packaging: Cut Tape (CT); ComponentLink1URL: http://www.analog.com/static/imported-files/Data_Sheets/ADR121_125_127.pdf; ComponentLink1Description: http://www.analog.com/static/imported-files/Data_Sheets/ADR121_125_127.pdf

## Sheet MKXdbV2_ADC1.SchDoc
size A
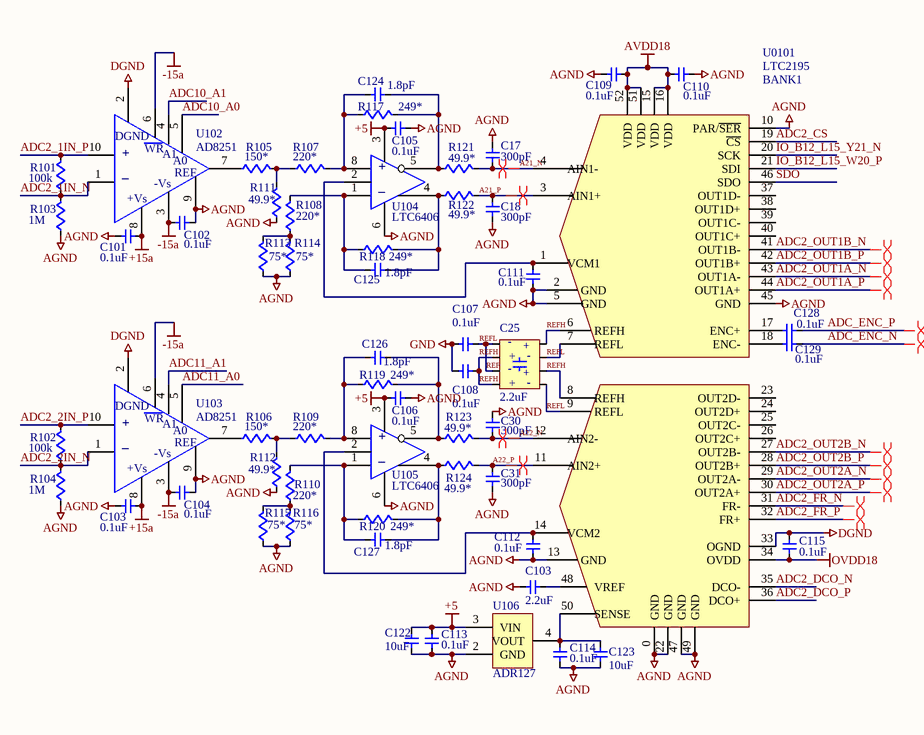
[diagram p5: MKXdbV2_ADC1.SchDoc]

### Parts
(Parts that share a designator on the sheet are numbered #1, #2 ... from top to bottom, then left to right.)
C17  300pF  [0603w]
C18  300pF  [0603w]
C25  2.2uF  [1206CLL]
C30  300pF  [0603w]
C31  300pF  [0603w]
C101#2  0.1uF  [0603w]
C102#2  0.1uF  [0603w]
C103#1  0.1uF  [0603w]
C103#2  2.2uF  [0603w]
C104#2  0.1uF  [0603w]
C105#2  0.1uF  [0603w]
C106  0.1uF  [0603w]
C107  0.1uF  [0603w]
C108  0.1uF  [0603w]
C109  0.1uF  [0603w]
C110  0.1uF  [0603w]
C111  0.1uF  [0603w]
C112  0.1uF  [0603w]
C113  0.1uF  [0603w]
C114  0.1uF  [0603w]
C115  0.1uF  [0603w]
C122  10uF  [0603w]
C123  10uF  [0603w]
C124  1.8pF  [0603w]
C125  1.8pF  [0603w]
C126  1.8pF  [0603w]
C127  1.8pF  [0603w]
C128#2  0.1uF  [1206]
C129#2  0.1uF  [1206]
R101  100k  [0603w]
R102  100k  [0603w]
R103  1M  [0603w]
R104  1M  [0603w]
R105  150*  [0603w]
R106  150*  [0603w]
R107  220*  [0603w]
R108  220*  [0603w]
R109  220*  [0603w]
R110  220*  [0603w]
R111  49.9*  [0603w]
R112  49.9*  [0603w]
R113  75*  [0603w]
R114  75*  [0603w]
R115  75*  [0603w]
R116  75*  [0603w]
R117  249*  [0603w]
R118  249*  [0603w]
R119  249*  [0603w]
R120  249*  [0603w]
R121  49.9*  [0603w]
R122  49.9*  [0603w]
R123  49.9*  [0603w]
R124  49.9*  [0603w]
U0101  LTC2195  [UKG - QFN52]
U102  AD8251  [MSOP10sm]
U103  AD8251  [MSOP10sm]
U104  LTC6406  [MSOP08]
U105  LTC6406  [MSOP08]
U106  ADR127  [TSOT-6]

### Nets
+5: C105#2.1 C106.1 C113.2 C122.1 U104.3 U105.3 U106.3(VIN)
+15a: C101#2.1 C103#1.1 U102.8 U103.8
-15a: C102#2.1 C104#2.1 U102.3 U102.6 U103.3 U103.6
AGND: C17.1 C18.2 C30.1 C31.2 C101#2.2 C102#2.2 C103#1.2 C103#2.2 C104#2.2 C105#2.2 C106.2 C107.2 C108.2 C109.2 C110.2 C111.2 C112.2 C113.1 C114.1 C115.1 C122.2 C123.2 R103.1 R104.1 R111.1 R112.1 R113.1 R114.1 R115.1 R116.1 U0101.0(GND) U0101.2(GND) U0101.5(GND) U0101.10(PAR/~{SER}) U0101.13(GND) U0101.22(GND) U0101.33(OGND) U0101.45(GND) U0101.47(GND) U0101.49(GND) U102.2 U102.9 U103.2 U103.9 U104.6 U105.6 U106.2(GND)  [also labelled DGND, GND]
AVDD18: C109.1 C110.1 U0101.15(VDD) U0101.16(VDD) U0101.51(VDD) U0101.52(VDD)
OVDD18: C115.2 U0101.34(OVDD)
A21_N: C17.2 R121.2 U0101.4(AIN1-)
A21_P: C18.1 R122.2 U0101.3(AIN1+)
A22_N: C30.2 R123.2 U0101.12(AIN2-)
A22_P: C31.1 R124.2 U0101.11(AIN2+)
ADC2_1IN_N: R101.1 R103.2 U102.1
ADC2_1IN_P: R101.2 U102.10
ADC2_2IN_N: R102.1 R104.2 U103.1
ADC2_2IN_P: R102.2 U103.10
ADC2_CS: U0101.19(~{CS})
ADC2_DCO_N: U0101.35(DCO-)
ADC2_DCO_P: U0101.36(DCO+)
ADC2_FR_N: U0101.31(FR-)
ADC2_FR_P: U0101.32(FR+)
ADC2_OUT1A_N: U0101.43(OUT1A-)
ADC2_OUT1A_P: U0101.44(OUT1A+)
ADC2_OUT1B_N: U0101.41(OUT1B-)
ADC2_OUT1B_P: U0101.42(OUT1B+)
ADC2_OUT2A_N: U0101.29(OUT2A-)
ADC2_OUT2A_P: U0101.30(OUT2A+)
ADC2_OUT2B_N: U0101.27(OUT2B-)
ADC2_OUT2B_P: U0101.28(OUT2B+)
ADC10_A0: U102.5
ADC10_A1: U102.4
ADC11_A0: U103.5
ADC11_A1: U103.4
ADC_ENC_N: C129#2.2
ADC_ENC_P: C128#2.2
IO_B12_L15_W20_P: U0101.21(SDI)
IO_B12_L15_Y21_N: U0101.20(SCK)
REFH: C25.2 C25.4 C25.6 C25.8 C108.1 U0101.6(REFH) U0101.8(REFH)
REFL: C25.1 C25.3 C25.5 C25.7 C107.1 U0101.7(REFL) U0101.9(REFL)
SDO: U0101.46(SDO)
NetC103#2_1: C103#2.1 U0101.48(VREF)
NetC111_1: C111.1 U0101.1(VCM1) U104.2
NetC112_1: C112.1 U0101.14(VCM2) U105.2
NetC114_2: C114.2 C123.1 U0101.50(SENSE) U106.4(VOUT)
NetC124_1: C124.1 R107.2 R117.1 U104.8
NetC124_2: C124.2 R117.2 R121.1 U104.5
NetC125_1: C125.1 R108.2 R118.1 U104.1
NetC125_2: C125.2 R118.2 R122.1 U104.4
NetC126_1: C126.1 R109.2 R119.1 U105.8
NetC126_2: C126.2 R119.2 R123.1 U105.5
NetC127_1: C127.1 R110.2 R120.1 U105.1
NetC127_2: C127.2 R120.2 R124.1 U105.4
NetC128#2_1: C128#2.1 U0101.17(ENC+)
NetC129#2_1: C129#2.1 U0101.18(ENC-)
NetR105_1: R105.1 U102.7
NetR105_2: R105.2 R107.1 R111.2
NetR106_1: R106.1 U103.7
NetR106_2: R106.2 R109.1 R112.2
NetR108_1: R108.1 R113.2 R114.2
NetR110_1: R110.1 R115.2 R116.2

Not connected (* = marked no-connect by the designer): U0101 23(OUT2D-) 24(OUT2D+) 25(OUT2C-) 26(OUT2C+) 37(OUT1D-) 38(OUT1D+) 39(OUT1C-) 40(OUT1C+); U106 1(NC) 5(NC) 6(NC)

### Layout directives
differential pair: A21_N, A21_P, A22_N, A22_P, ADC2_FR_N, ADC2_FR_P, ADC2_OUT1A_N, ADC2_OUT1A_P, ADC2_OUT1B_N, ADC2_OUT1B_P, ADC2_OUT2A_N, ADC2_OUT2A_P, ADC2_OUT2B_N, ADC2_OUT2B_P, ADC_ENC_N, ADC_ENC_P

### Notes on the sheet
- (near U0101) BANK1
- (in symbol AD8139) +; _
- (in symbol AD8251) DGND; WR; +; A1; A0; _; REF; -Vs; +Vs
- (in symbol CAP_SM Interdigitated) +

### Library data of the parts
C17 C18 C30 C31 C124-C127 = CAP_SM_1: capacitor; Supplier 1: Digi-Key
  C17 C18 C30 C31: Supplier Part Number 1: 490-1438-1-ND
  C124-C127: Supplier Part Number 1: 712-1328-1-ND
C25 = CAP_SM Interdigitated: as C020 on sheet MKXdbV2_ADC0; Supplier 1: Digi-Key; Supplier Part Number 1: 445-3406-1-ND; RoHS: RoHS Compliant; Category: Capacitors; Stock 1: 11249; Pricing 1: 1=0.68, 10=0.54, 100=0.325, 250=0.24376, 500=0.208, 1000=0.1625 (USD); Mounting Type: Surface Mount, MLCC; Operating Temperature: -55°C ~ 125°C; Applications: General Purpose; Ratings: -; Package / Case: 0805 (2012 Metric); Size / Dimension: 0.079" L x 0.049" W (2.00mm x 1.25mm); Height: -; Thickness: 0.037" (0.95mm); Lead Spacing: -; Features: Low ESL (Multi-Terminal); Packaging: Cut Tape (CT); Lead Style: -; ComponentLink1URL: http://www.tdk.com/pdf/uli_A11.pdf; ComponentLink1Description: http://www.tdk.com/pdf/uli_A11.pdf
C101#2 C102#2 C103#1 C104#2 C106-C115 = CAP_SM_1: as C001 on sheet MKXdbV2_ADC0; Applications: General Purpose; Category: Capacitors; ComponentLink1Description: http://www.kemet.com/datasheets&C0603C104K3RACTU; ComponentLink1URL: http://www.kemet.com/datasheets&C0603C104K3RACTU; Features: -; Lead Spacing: -; Lead Style: -; Mounting Type: Surface Mount, MLCC; Operating Temperature: -55°C ~ 125°C; Package / Case: 0603 (1608 Metric); Packaging: Cut Tape (CT); Pricing 1: 10=0.075, 100=0.027, 250=0.01952, 500=0.0144, 1000=0.00975 (USD); Ratings: -; RoHS: RoHS Compliant; Size / Dimension: 0.063" L x 0.031" W (1.60mm x 0.80mm); Stock 1: 1185883; Supplier 1: Digi-Key; Supplier Part Number 1: 399-1281-1-ND; Thickness: 0.034" (0.87mm)
C103#2 = CAP_SM_1: as C021 on sheet MKXdbV2_ADC0; Supplier 1: Digi-Key; Supplier Part Number 1: 478-5316-1-ND; RoHS: RoHS Compliant; Category: Capacitors; Stock 1: 284343; Pricing 1: 10=0.209, 100=0.1235, 500=0.07126, 1000=0.0494 (USD); Mounting Type: Surface Mount, MLCC; Operating Temperature: -55°C ~ 125°C; Applications: General Purpose; Ratings: -; Package / Case: 0603 (1608 Metric); Size / Dimension: 0.063" L x 0.032" W (1.60mm x 0.81mm); Height: -; Thickness: 0.035" (0.90mm); Lead Spacing: -; Features: -; Packaging: Cut Tape (CT); Lead Style: -; ComponentLink1URL: http://www.avx.com/docs/Catalogs/cx7r.pdf; ComponentLink1Description: http://www.avx.com/docs/Catalogs/cx7r.pdf
C105#2 = CAP_SM_1: as C005 on sheet MKXdbV2_ADC0; Supplier 1: Digi-Key; Supplier Part Number 1: 399-1281-1-ND; RoHS: RoHS Compliant; Category: Capacitors; Stock 1: 1185883; Pricing 1: 10=0.075, 100=0.027, 250=0.01952, 500=0.0144, 1000=0.00975 (USD); Mounting Type: Surface Mount, MLCC; Operating Temperature: -55°C ~ 125°C; Applications: General Purpose; Ratings: -; Package / Case: 0603 (1608 Metric); Size / Dimension: 0.063" L x 0.031" W (1.60mm x 0.80mm); Height: -; Thickness: 0.034" (0.87mm); Lead Spacing: -; Features: -; Packaging: Cut Tape (CT); Lead Style: -; ComponentLink1URL: http://www.kemet.com/datasheets&C0603C104K3RACTU; ComponentLink1Description: http://www.kemet.com/datasheets&C0603C104K3RACTU
C122 C123 = CAP_SM_1: as C022 on sheet MKXdbV2_ADC0; Supplier 1: Digi-Key; Supplier Part Number 1: 490-3896-1-ND; RoHS: RoHS Compliant; Category: Capacitors; Stock 1: 1274844; Pricing 1: 1=0.47, 10=0.369, 50=0.2428, 100=0.1926, 250=0.14236, 500=0.11056, 1000=0.0871 (USD); Mounting Type: Surface Mount, MLCC; Operating Temperature: -55°C ~ 85°C; Applications: General Purpose; Ratings: -; Package / Case: 0603 (1608 Metric); Size / Dimension: 0.063" L x 0.031" W (1.60mm x 0.80mm); Height: -; Thickness: 0.035" (0.90mm); Lead Spacing: -; Features: -; Packaging: Cut Tape (CT); Lead Style: -; ComponentLink1URL: http://search.murata.co.jp/Ceramy/image/img/PDF/ENG/GRM188R60J106ME47.pdf; ComponentLink1Description: http://search.murata.co.jp/Ceramy/image/img/PDF/ENG/GRM188R60J106ME47.pdf
C128#2 C129#2 = CAP_SM_1: as C028 on sheet MKXdbV2_ADC0; Supplier 1: Digi-Key; Supplier Part Number 1: 490-1767-1-ND; RoHS: RoHS Compliant; Category: Capacitors; Stock 1: 374793; Pricing 1: 1=0.57, 10=0.48, 50=0.3436, 100=0.3007, 250=0.23628, 500=0.2148, 1000=0.17184 (USD); Mounting Type: Surface Mount, MLCC; Operating Temperature: -55°C ~ 125°C; Applications: General Purpose; Ratings: -; Package / Case: 1206 (3216 Metric); Size / Dimension: 0.126" L x 0.063" W (3.20mm x 1.60mm); Height: -; Thickness: 0.071" (1.80mm); Lead Spacing: -; Features: -; Packaging: Cut Tape (CT); Lead Style: -; ComponentLink1URL: http://search.murata.co.jp/Ceramy/image/img/PDF/ENG/GRM31C5C1E104JA01.pdf; ComponentLink1Description: http://search.murata.co.jp/Ceramy/image/img/PDF/ENG/GRM31C5C1E104JA01.pdf
R101 R102 = RES_SM: as R001 on sheet MKXdbV2_ADC0; Supplier 1: Digi-Key; Supplier Part Number 1: 311-100KHRCT-ND; RoHS: RoHS Compliant; Category: Resistors; Stock 1: 3397757; Pricing 1: 10=0.014, 50=0.0104, 100=0.0079, 250=0.00584, 500=0.00432, 1000=0.00288 (USD); Resistance (Ohms): 100K; Composition: Thick Film; Features: -; Size / Dimension: 0.063" L x 0.031" W (1.60mm x 0.80mm); Height: 0.018" (0.45mm); Number of Terminations: 2; Packaging: Cut Tape (CT); Package / Case: 0603 (1608 Metric); ComponentLink1URL: http://www.yageo.com/documents/recent/PYu-RC0603_51_RoHS_L_4.pdf; ComponentLink1Description: http://www.yageo.com/documents/recent/PYu-RC0603_51_RoHS_L_4.pdf
R103 R104 = RES_SM: as R003 on sheet MKXdbV2_ADC0; Supplier 1: Digi-Key; Supplier Part Number 1: 311-1.00MHRCT-ND; RoHS: RoHS Compliant; Category: Resistors; Stock 1: 1849601; Pricing 1: 10=0.014, 50=0.0104, 100=0.0079, 250=0.00584, 500=0.00432, 1000=0.00288 (USD); Resistance (Ohms): 1M; Composition: Thick Film; Features: -; Size / Dimension: 0.063" L x 0.031" W (1.60mm x 0.80mm); Height: 0.018" (0.45mm); Number of Terminations: 2; Packaging: Cut Tape (CT); Package / Case: 0603 (1608 Metric); ComponentLink1URL: http://www.yageo.com/documents/recent/PYu-RC0603_51_RoHS_L_4.pdf; ComponentLink1Description: http://www.yageo.com/documents/recent/PYu-RC0603_51_RoHS_L_4.pdf
R105-R110 R117-R120 = RES_SM: resistor; Supplier 1: Digi-Key
  R105 R106: Supplier Part Number 1: RNCS0603BKE150RCT-ND
  R107-R110: Supplier Part Number 1: RG16P220BCT-ND
  R117-R120: Supplier Part Number 1: RNCS0603BKE249RCT-ND
R111 R112 R121-R124 = RES_SM: as R011 on sheet MKXdbV2_ADC0; Supplier 1: Digi-Key; Supplier Part Number 1: RNCS0603BKE49R9CT-ND; RoHS: RoHS Compliant; Category: Resistors; Stock 1: 13782; Pricing 1: 1=0.7, 10=0.475, 50=0.2876, 100=0.2375, 250=0.18752, 500=0.16 (USD); Composition: Thin Film; Features: Anti-Corrosive, Moisture Resistant; Size / Dimension: 0.061" L x 0.031" W (1.55mm x 0.80mm); Height: 0.018" (0.45mm); Number of Terminations: 2; Packaging: Cut Tape (CT); Package / Case: 0603 (1608 Metric); ComponentLink1URL: http://www.seielect.com/Catalog/SEI-rncs.pdf; ComponentLink1Description: http://www.seielect.com/Catalog/SEI-rncs.pdf
R113-R116 = RES_SM: as R013 on sheet MKXdbV2_ADC0; Supplier 1: Digi-Key; Supplier Part Number 1: RNCS0603BKE75R0CT-ND; RoHS: RoHS Compliant; Category: Resistors; Stock 1: 2583; Pricing 1: 1=0.7, 10=0.475, 50=0.2876, 100=0.2375, 250=0.18752, 500=0.16 (USD); Composition: Thin Film; Features: Anti-Corrosive, Moisture Resistant; Size / Dimension: 0.061" L x 0.031" W (1.55mm x 0.80mm); Height: 0.018" (0.45mm); Number of Terminations: 2; Packaging: Cut Tape (CT); Package / Case: 0603 (1608 Metric); ComponentLink1URL: http://www.seielect.com/Catalog/SEI-rncs.pdf; ComponentLink1Description: http://www.seielect.com/Catalog/SEI-rncs.pdf
U0101 = LTC2195: 16 bit, low power, dual ADC; Supplier 1: Digi-Key; Supplier Part Number 1: LTC2195CUKG#PBF-ND
U102 = AD8251: Programmable Gain Instumentation Amp; Supplier 1: Digi-Key; Supplier Part Number 1: AD8251ARMZ-ND
U103 = AD8251: IC AMP INST ICMOS LDRIFT 10MSOP; Supplier 1: Digi-Key; Supplier Part Number 1: AD8251ARMZ-ND
U104 U105 = AD8139: Differential ADC Driver; Supplier 1: Digi-Key; Supplier Part Number 1: LTC6406CMS8E#PBF-ND
U106 = ADR12x: as U006 on sheet MKXdbV2_ADC0; Supplier 1: Digi-Key; Supplier Part Number 1: ADR127AUJZ-REEL7CT-ND; RoHS: RoHS Compliant; Category: Integrated Circuits (ICs); Stock 1: 17098; Pricing 1: 1=3.22, 25=2.484, 100=2.254, 250=2.024, 500=1.748 (USD); Current - Cathode: -; Operating Temperature: -40°C ~ 125°C; Mounting Type: Surface Mount; Package / Case: TSOT-23-6, TSOT-6; Supplier Device Package: TSOT-6; Packaging: Cut Tape (CT); ComponentLink1URL: http://www.analog.com/static/imported-files/Data_Sheets/ADR121_125_127.pdf; ComponentLink1Description: http://www.analog.com/static/imported-files/Data_Sheets/ADR121_125_127.pdf

## Nets that join several sheets
+5: MKXdbV2_PWR (C59.1 L8.2), MKXdbV2_ADC0 (7 pins), MKXdbV2_ADC1 (7 pins)
+15a: MKXdbV2_PWR (C98.1 L26.2), MKXdbV2_ADC0 (C001.1 C003.1 U002.8 U003.8), MKXdbV2_ADC1 (C101#2.1 C103#1.1 U102.8 U103.8)
-15a: MKXdbV2_PWR (C104#1.2 L28.2), MKXdbV2_ADC0 (6 pins), MKXdbV2_ADC1 (6 pins)
AGND: MKXdbV2_ModConn (64 pins), MKXdbV2_DAC1 (26 pins), DAC0 (26 pins), CommConn (26 pins), MKXdbV2_PWR (44 pins), MKXdbV2_ADC0 (47 pins), MKXdbV2_ADC1 (47 pins)
AVDD18: MKXdbV2_PWR (C69.1 L16.2), MKXdbV2_ADC0 (6 pins), MKXdbV2_ADC1 (6 pins)
AVDD33: MKXdbV2_DAC1 (6 pins), DAC0 (6 pins), CommConn (6 pins), MKXdbV2_PWR (6 pins)
CVDD18: MKXdbV2_DAC1 (5 pins), DAC0 (5 pins), CommConn (5 pins), MKXdbV2_PWR (C66.1 L14.2)
DVDD18: MKXdbV2_DAC1 (C144.2 C145.2 U21.8 U21.47), DAC0 (C79_DAC0.2 C80_DAC0.2 U12_DAC0.8 U12_DAC0.47), CommConn (C79_CommConn.2 C80_CommConn.2 U12_CommConn.8 U12_CommConn.47), MKXdbV2_PWR (C71.1 L18.2)
DVDD25: MKXdbV2_ModConn (10 pins), MKXdbV2_PWR (6 pins)
DVDD33: MKXdbV2_ModConn (J700.10), MKXdbV2_DAC1 (C139.1 U21.27), DAC0 (C77_DAC0.1 U12_DAC0.27), CommConn (C77_CommConn.1 U12_CommConn.27), MKXdbV2_PWR (6 pins)
OVDD18: MKXdbV2_PWR (C84.1 L22.2), MKXdbV2_ADC0 (C015.2 U001.34), MKXdbV2_ADC1 (C115.2 U0101.34)
ADC_ENC_N: MKXdbV2_ADC0 (C029.2), MKXdbV2_ADC1 (C129#2.2)
ADC_ENC_P: MKXdbV2_ADC0 (C028.2), MKXdbV2_ADC1 (C128#2.2)
D_SCLK: MKXdbV2_DAC1 (U21.51), DAC0 (U12_DAC0.51), CommConn (U12_CommConn.51)
D_SDIO: MKXdbV2_DAC1 (U21.50), DAC0 (U12_DAC0.50), CommConn (U12_CommConn.50)
D_SDO: MKXdbV2_DAC1 (U21.49), DAC0 (U12_DAC0.49), CommConn (U12_CommConn.49)
DAC1_CLK_IN_N: DAC0 (C38_DAC0.2 R30_DAC0.1 U12_DAC0.4), CommConn (C38_CommConn.2 R30_CommConn.1 U12_CommConn.4)
DAC1_CLK_IN_P: DAC0 (C37_DAC0.2 R29_DAC0.1 U12_DAC0.3), CommConn (C37_CommConn.2 R29_CommConn.1 U12_CommConn.3)
DAC1_CSB: DAC0 (U12_DAC0.52), CommConn (U12_CommConn.52)
DAC1_D0_N: DAC0 (U12_DAC0.46), CommConn (U12_CommConn.46)
DAC1_D0_P: DAC0 (U12_DAC0.45), CommConn (U12_CommConn.45)
DAC1_D1_N: DAC0 (U12_DAC0.44), CommConn (U12_CommConn.44)
DAC1_D1_P: DAC0 (U12_DAC0.43), CommConn (U12_CommConn.43)
DAC1_D2_N: DAC0 (U12_DAC0.42), CommConn (U12_CommConn.42)
DAC1_D2_P: DAC0 (U12_DAC0.41), CommConn (U12_CommConn.41)
DAC1_D3_N: DAC0 (U12_DAC0.40), CommConn (U12_CommConn.40)
DAC1_D3_P: DAC0 (U12_DAC0.39), CommConn (U12_CommConn.39)
DAC1_D4_N: DAC0 (U12_DAC0.38), CommConn (U12_CommConn.38)
DAC1_D4_P: DAC0 (U12_DAC0.37), CommConn (U12_CommConn.37)
DAC1_D5_N: DAC0 (U12_DAC0.36), CommConn (U12_CommConn.36)
DAC1_D5_P: DAC0 (U12_DAC0.35), CommConn (U12_CommConn.35)
DAC1_D6_N: DAC0 (U12_DAC0.34), CommConn (U12_CommConn.34)
DAC1_D6_P: DAC0 (U12_DAC0.33), CommConn (U12_CommConn.33)
DAC1_D7_N: DAC0 (U12_DAC0.32), CommConn (U12_CommConn.32)
DAC1_D7_P: DAC0 (U12_DAC0.31), CommConn (U12_CommConn.31)
DAC1_D8_N: DAC0 (U12_DAC0.24), CommConn (U12_CommConn.24)
DAC1_D8_P: DAC0 (U12_DAC0.23), CommConn (U12_CommConn.23)
DAC1_D9_N: DAC0 (U12_DAC0.22), CommConn (U12_CommConn.22)
DAC1_D9_P: DAC0 (U12_DAC0.21), CommConn (U12_CommConn.21)
DAC1_D10_N: DAC0 (U12_DAC0.20), CommConn (U12_CommConn.20)
DAC1_D10_P: DAC0 (U12_DAC0.19), CommConn (U12_CommConn.19)
DAC1_D11_N: DAC0 (U12_DAC0.18), CommConn (U12_CommConn.18)
DAC1_D11_P: DAC0 (U12_DAC0.17), CommConn (U12_CommConn.17)
DAC1_D12_N: DAC0 (U12_DAC0.16), CommConn (U12_CommConn.16)
DAC1_D12_P: DAC0 (U12_DAC0.15), CommConn (U12_CommConn.15)
DAC1_D13_N: DAC0 (U12_DAC0.14), CommConn (U12_CommConn.14)
DAC1_D13_P: DAC0 (U12_DAC0.13), CommConn (U12_CommConn.13)
DAC1_D14_N: DAC0 (U12_DAC0.12), CommConn (U12_CommConn.12)
DAC1_D14_P: DAC0 (U12_DAC0.11), CommConn (U12_CommConn.11)
DAC1_D15_N: DAC0 (U12_DAC0.10), CommConn (U12_CommConn.10)
DAC1_D15_P: DAC0 (U12_DAC0.9), CommConn (U12_CommConn.9)
DAC1_DCI_N: DAC0 (U12_DAC0.30), CommConn (U12_CommConn.30)
DAC1_DCI_P: DAC0 (U12_DAC0.29), CommConn (U12_CommConn.29)
DAC1_DCO_N: DAC0 (U12_DAC0.26), CommConn (U12_CommConn.26)
DAC1_DCO_P: DAC0 (U12_DAC0.25), CommConn (U12_CommConn.25)
DAC1_RESET: DAC0 (U12_DAC0.53), CommConn (U12_CommConn.53)
DAC_CLK_N: MKXdbV2_DAC1 (C133.1), DAC0 (C38_DAC0.1), CommConn (C38_CommConn.1)
DAC_CLK_P: MKXdbV2_DAC1 (C132.1), DAC0 (C37_DAC0.1), CommConn (C37_CommConn.1)
IO_B12_L6_N: MKXdbV2_ModConn (J700.33), MKXdbV2_ADC0 (U001.35)
IO_B12_L6_P: MKXdbV2_ModConn (J700.31), MKXdbV2_ADC0 (U001.36)
IO_B12_L15_W20_P: MKXdbV2_ADC0 (U001.21), MKXdbV2_ADC1 (U0101.21)
IO_B12_L15_Y21_N: MKXdbV2_ADC0 (U001.20), MKXdbV2_ADC1 (U0101.20)
REFH: MKXdbV2_ADC0 (7 pins), MKXdbV2_ADC1 (7 pins)
REFL: MKXdbV2_ADC0 (7 pins), MKXdbV2_ADC1 (7 pins)
SDO: MKXdbV2_ADC0 (U001.46), MKXdbV2_ADC1 (U0101.46)